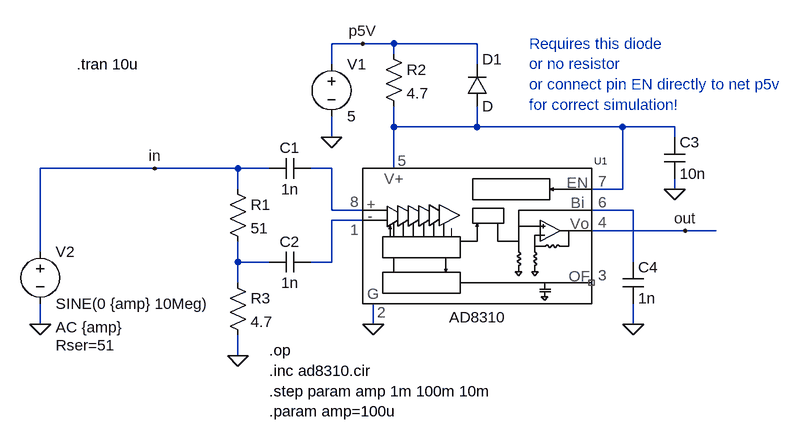
[diagram p0: schematic ad8310-1.asc]
ad8310-1.asc, the LTspice schematic file:
Version 4
SHEET 1 960 680
WIRE -32 -48 -80 -48
WIRE 16 -48 -32 -48
WIRE 144 -48 16 -48
WIRE 16 -32 16 -48
WIRE -80 -16 -80 -48
WIRE 144 -16 144 -48
WIRE 16 80 16 48
WIRE 144 80 144 48
WIRE 144 80 16 80
WIRE 368 80 144 80
WIRE 448 80 368 80
WIRE -80 96 -80 64
WIRE 448 96 448 80
WIRE -352 144 -528 144
WIRE -224 144 -352 144
WIRE -176 144 -224 144
WIRE -80 144 -112 144
WIRE 16 144 16 80
WIRE -224 176 -224 144
WIRE 368 176 368 80
WIRE 368 176 320 176
WIRE 448 176 448 160
WIRE -80 208 -80 144
WIRE -32 208 -80 208
WIRE 384 208 320 208
WIRE -32 224 -80 224
WIRE 464 240 320 240
WIRE 512 240 464 240
WIRE -528 272 -528 144
WIRE -224 288 -224 256
WIRE -176 288 -224 288
WIRE -80 288 -80 224
WIRE -80 288 -112 288
WIRE 384 288 384 208
WIRE -224 320 -224 288
WIRE -528 384 -528 352
WIRE -16 384 -16 352
WIRE 384 384 384 352
WIRE -224 432 -224 400
FLAG -16 384 0
FLAG -224 432 0
FLAG -80 96 0
FLAG -528 384 0
FLAG -352 144 in
FLAG 464 240 out
FLAG -32 -48 p5V
FLAG 448 176 0
FLAG 384 384 0
SYMBOL res -240 160 R0
SYMATTR InstName R1
SYMATTR Value 51
SYMATTR SpiceLine tol=5 pwr=0.5
SYMBOL cap -112 128 R90
WINDOW 0 0 32 VBottom 0
WINDOW 3 32 32 VTop 0
SYMATTR InstName C1
SYMATTR Value 1n
SYMATTR SpiceLine V=10 Irms=10.541 Rser=0.004 MTBF=0 Lser=0 mfg="KEMET" pn="C0603C105K8PAC" type="X5R" ppPkg=1
SYMBOL cap -112 272 R90
WINDOW 0 0 32 VBottom 0
WINDOW 3 32 32 VTop 0
SYMATTR InstName C2
SYMATTR Value 1n
SYMATTR SpiceLine V=10 Irms=10.541 Rser=0.004 MTBF=0 Lser=0 mfg="KEMET" pn="C0603C105K8PAC" type="X5R" ppPkg=1
SYMBOL voltage -80 -32 R0
WINDOW 123 0 0 Left 0
WINDOW 39 0 0 Left 0
SYMATTR InstName V1
SYMATTR Value 5
SYMBOL voltage -528 256 R0
WINDOW 123 24 132 Left 0
WINDOW 39 24 160 Left 0
SYMATTR Value2 AC {amp}
SYMATTR SpiceLine Rser=51
SYMATTR InstName V2
SYMATTR Value SINE(0 {amp} 10Meg)
SYMBOL cap 432 96 R0
SYMATTR InstName C3
SYMATTR Value 10n
SYMATTR SpiceLine V=10 Irms=10.541 Rser=0.004 MTBF=0 Lser=0 mfg="KEMET" pn="C0603C105K8PAC" type="X5R" ppPkg=1
SYMBOL res -240 304 R0
SYMATTR InstName R3
SYMATTR Value 4.7
SYMATTR SpiceLine tol=5 pwr=0.25
SYMBOL AD8310 32 176 R0
SYMATTR InstName U1
SYMBOL cap 368 288 R0
SYMATTR InstName C4
SYMATTR Value 1n
SYMBOL res 0 -48 R0
SYMATTR InstName R2
SYMATTR Value 4.7
SYMBOL diode 128 48 M180
WINDOW 0 24 72 Left 0
WINDOW 3 24 0 Left 0
SYMATTR InstName D1
TEXT -176 424 Left 0 !.op\n.inc ad8310.cir\n.step param amp 1m 100m 10m\n.param amp=100u
TEXT -472 -16 Left 0 !.tran 10u
TEXT 224 -48 Left 0 ;Requires this diode \nor no resistor \nor connect pin EN directly to net p5v\nfor correct simulation!

The netlist it stands for:
* ad8310-1.asc
R1 in N005 51 tol=5 pwr=0.5
C1 N002 in 1n V=10 Irms=10.541 Rser=0.004 MTBF=0 Lser=0 mfg="KEMET" pn="C0603C105K8PAC" type="X5R" ppPkg=1
C2 N004 N005 1n V=10 Irms=10.541 Rser=0.004 MTBF=0 Lser=0 mfg="KEMET" pn="C0603C105K8PAC" type="X5R" ppPkg=1
V1 p5V 0 5
V2 in 0 SINE(0 {amp} 10Meg) AC {amp} Rser=51
C3 N001 0 10n V=10 Irms=10.541 Rser=0.004 MTBF=0 Lser=0 mfg="KEMET" pn="C0603C105K8PAC" type="X5R" ppPkg=1
R3 N005 0 4.7 tol=5 pwr=0.25
XU1 N001 N002 N004 0 N001 N003 out NC_01 AD8310  ; pins V+ VI+ VI- GND ENAB BUFIN VOUT OFFSFILT
C4 N003 0 1n
R2 p5V N001 4.7
D1 N001 p5V D
.model D D
.lib standard.dio
.op
.inc ad8310.cir
.step param amp 1m 100m 10m
.param amp=100u
.tran 10u
* Requires this diode
* or no resistor
* or connect pin EN directly to net p5v
* for correct simulation!
.backanno
.end